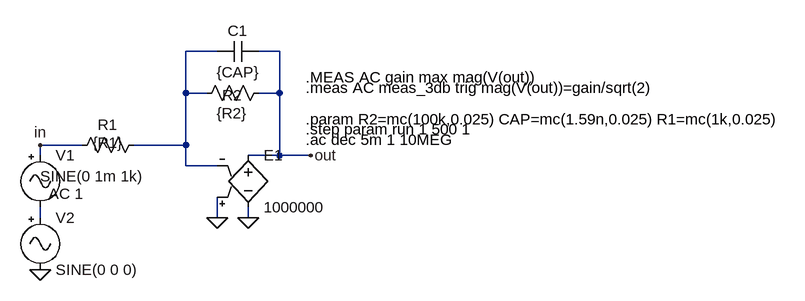
[diagram p0: schematic passabaixa-corte1k.asc]
passabaixa-corte1k.asc, the LTspice schematic file:
Version 4
SHEET 1 1024 680
WIRE 144 48 96 48
WIRE 240 48 208 48
WIRE 96 112 96 48
WIRE 128 112 96 112
WIRE 240 112 240 48
WIRE 240 112 208 112
WIRE -64 192 -128 192
WIRE 96 192 96 112
WIRE 96 192 16 192
WIRE -128 208 -128 192
WIRE 240 208 240 112
WIRE 240 208 192 208
WIRE 288 208 240 208
WIRE 96 224 96 192
WIRE 144 224 96 224
WIRE -128 304 -128 288
WIRE 144 304 144 272
WIRE 192 304 192 288
FLAG -128 192 in
FLAG 288 208 out
FLAG 144 304 0
FLAG 192 304 0
FLAG -128 384 0
SYMBOL res 224 96 R90
WINDOW 0 35 57 VBottom 2
WINDOW 3 63 57 VBottom 2
SYMATTR InstName R2
SYMATTR Value {R2}
SYMBOL cap 208 32 R90
WINDOW 0 0 32 VBottom 2
WINDOW 3 32 32 VTop 2
SYMATTR InstName C1
SYMATTR Value {CAP}
SYMBOL res 32 176 R90
WINDOW 0 0 56 VBottom 2
WINDOW 3 28 56 VBottom 2
SYMATTR InstName R1
SYMATTR Value {R1}
SYMBOL e2 192 192 R0
SYMATTR InstName E1
SYMATTR Value 1000000
SYMBOL Misc\\signal -128 192 R0
WINDOW 3 0 48 Left 2
WINDOW 123 13 75 Left 2
WINDOW 39 0 0 Left 2
SYMATTR Value SINE(0 1m 1k)
SYMATTR Value2 AC 1
SYMATTR InstName V1
SYMBOL Misc\\signal -128 288 R0
WINDOW 123 0 0 Left 2
WINDOW 39 0 0 Left 2
SYMATTR InstName V2
SYMATTR Value SINE(0 0 0)
TEXT 280 184 Left 2 !.ac dec 5m 1 10MEG
TEXT 280 88 Left 2 !.MEAS AC gain max mag(V(out))
TEXT 280 104 Left 2 !.meas AC meas_3db trig mag(V(out))=gain/sqrt(2)
TEXT 280 168 Left 2 !.step param run 1 500 1
TEXT 280 152 Left 2 !.param R2=mc(100k,0.025) CAP=mc(1.59n,0.025) R1=mc(1k,0.025)

The netlist it stands for:
* passabaixa-corte1k.asc
R2 out N001 {R2}
C1 out N001 {CAP}
R1 N001 in {R1}
E1 out 0 0 N001 1000000
V1 in N002 SINE(0 1m 1k) AC 1
V2 N002 0 SINE(0 0 0)
.ac dec 5m 1 10MEG
.MEAS AC gain max mag(V(out))
.meas AC meas_3db trig mag(V(out))=gain/sqrt(2)
.step param run 1 500 1
.param R2=mc(100k,0.025) CAP=mc(1.59n,0.025) R1=mc(1k,0.025)
.backanno
.end